# EAGLE design Mikrobus-PIC32MX-USB (EAGLE 7.7.0)
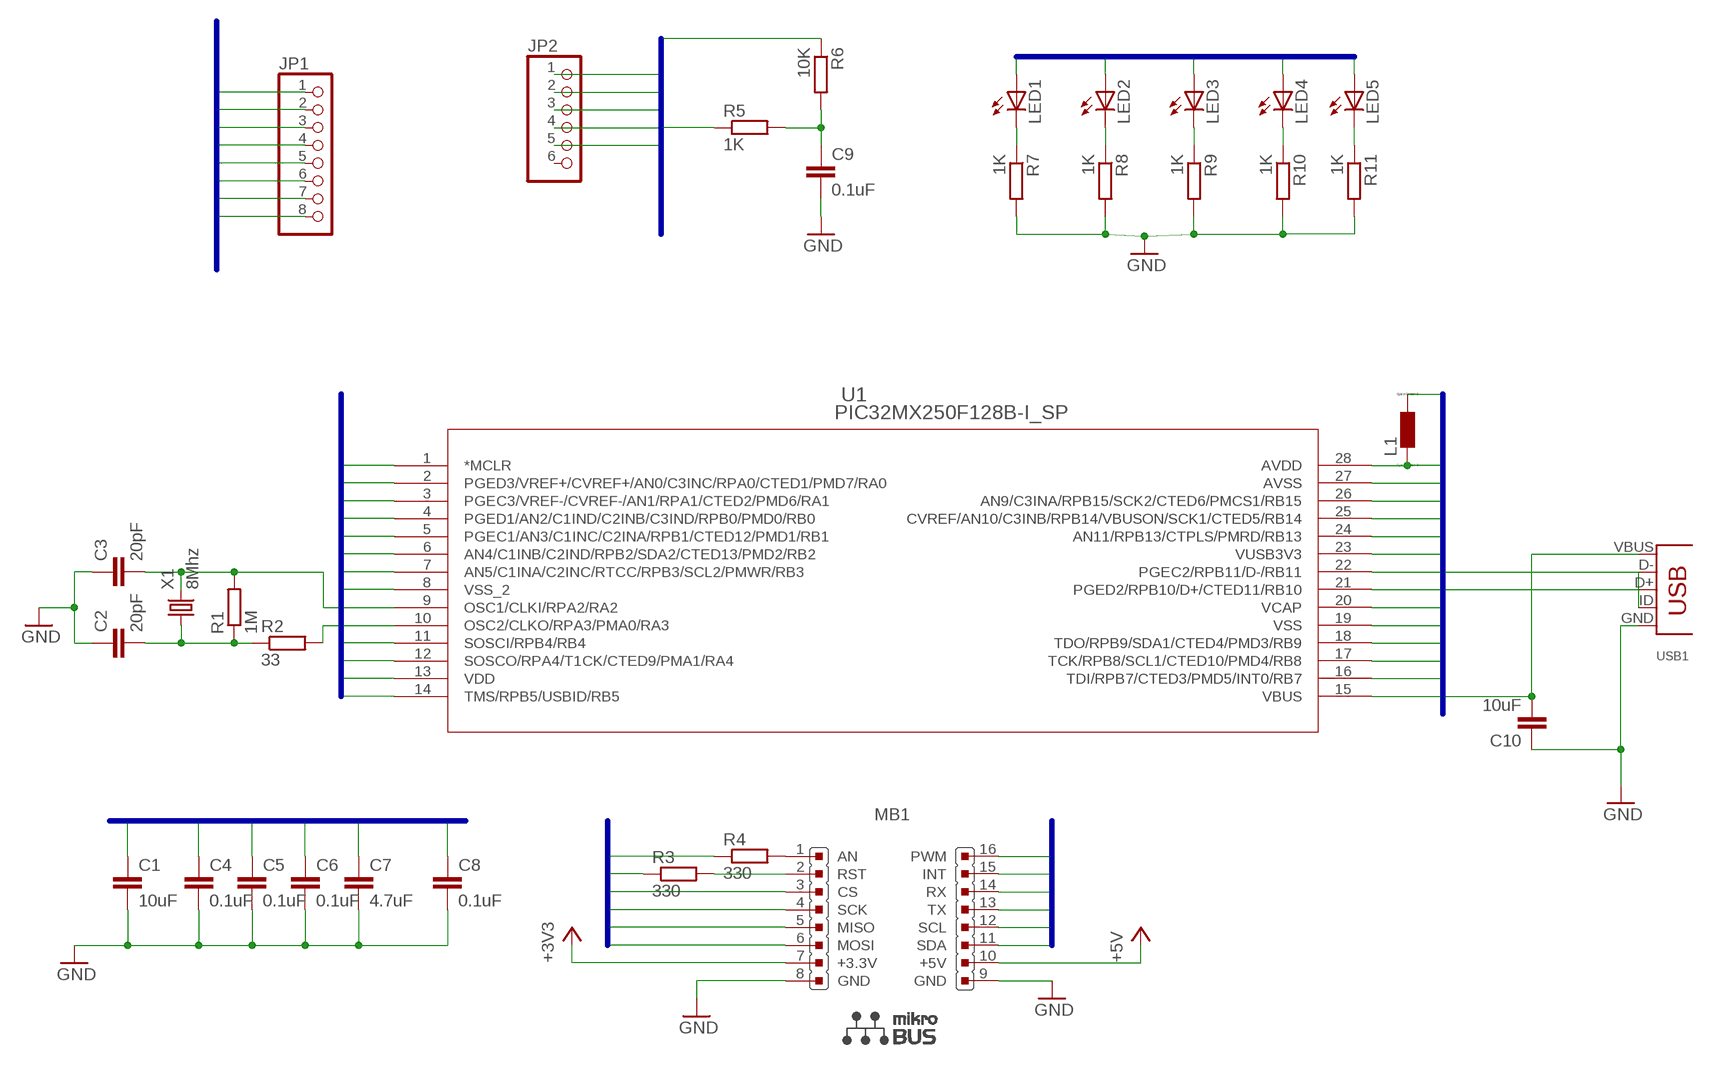
[diagram p0: schematic, sheet 1]

## Parts
C1  10uF  C-EU050-024X044  [C050-024X044]
C2  20pF  C-EU050-024X044  [C050-024X044]
C3  20pF  C-EU050-024X044  [C050-024X044]
C4  0.1uF  C-EU025-024X044  [C025-024X044]
C5  0.1uF  C-EU025-024X044  [C025-024X044]
C6  0.1uF  C-EU025-024X044  [C025-024X044]
C7  4.7uF  C-EU050-024X044  [C050-024X044]
C8  0.1uF  C-EU025-024X044  [C025-024X044]
C9  0.1uF  C-EU025-024X044  [C025-024X044]
C10  10uF  C-EU050-024X044  [C050-024X044]
JP1  PINHD-1X8  [1X08]
JP2  PINHD-1X6  [1X06]
L1  L  [MLF1608]
LED1  LED1.8MM  [LED1.8MM]
LED2  LED1.8MM  [LED1.8MM]
LED3  LED1.8MM  [LED1.8MM]
LED4  LED1.8MM  [LED1.8MM]
LED5  LED1.8MM  [LED1.8MM]
MB1  MIKROBUS  [MIKROBUS]
R1  1M  R-EU_0204/5  [0204/5]
R2  33  R-EU_0204/5  [0204/5]
R3  330  R-EU_0204/5  [0204/5]
R4  330  R-EU_0204/5  [0204/5]
R5  1K  R-EU_0204/5  [0204/5]
R6  10K  R-EU_0204/5  [0204/5]
R7  1K  R-EU_0204/5  [0204/5]
R8  1K  R-EU_0204/5  [0204/5]
R9  1K  R-EU_0204/5  [0204/5]
R10  1K  R-EU_0204/5  [0204/5]
R11  1K  R-EU_0204/5  [0204/5]
U1  PIC32MX250F128B-I_SP  [SPDIP28_300MC]
USB1  MICRO-USB  [USB-WURTH]
X1  8Mhz  CRYSTALS-NOGND-HC49  [HC49]

## Nets
+5V: MB1.10(+5V)
AVDD: C8.1 L1.2 U1.28(AVDD)
D+: U1.21(PGED2/RPB10/D+/CTED11/RB10) USB1.ID(D-)
D-: U1.22(PGEC2/RPB11/D-/RB11) USB1.D+
GND: C1.2 C2.1 C3.1 C4.2 C5.2 C6.2 C7.2 C8.2 C9.2 C10.1 JP1.8 JP2.3 MB1.8(GND) MB1.9(GND) R7.2 R8.2 R9.2 R10.2 R11.2 U1.8(VSS_2) U1.19(VSS) U1.27(AVSS) USB1.GND(VBUS)
INT: MB1.15(INT) U1.14(TMS/RPB5/USBID/RB5)
LED1: LED1.P1(A) U1.2(PGED3/VREF+/CVREF+/AN0/C3INC/RPA0/CTED1/PMD7/RA0)
LED2: LED2.P1(A) U1.26(AN9/C3INA/RPB15/SCK2/CTED6/PMCS1/RB15)
MCLR: JP2.1 R4.1 R5.1 U1.1(*MCLR)
MISO: MB1.5(MISO) U1.17(TCK/RPB8/SCL1/CTED10/PMD4/RB8)
MOSI: JP1.1 MB1.6(MOSI) U1.3(PGEC3/VREF-/CVREF-/AN1/RPA1/CTED2/PMD6/RA1)
N$2: C2.2 R1.1 R2.1 X1.1
N$8: MB1.1(AN) R4.2
N$9: C9.1 R5.2 R6.2
N$11: LED1.P2(C) R7.1
N$12: LED2.P2(C) R8.1
N$13: LED3.P2(C) R9.1
N$14: LED4.P2(C) R10.1
N$15: MB1.2(RST) R3.2
N$16: LED5.P2(C) R11.1
OSC1: C3.2 R1.2 U1.9(OSC1/CLKI/RPA2/RA2) X1.2
OSC2: R2.2 U1.10(OSC2/CLKO/RPA3/PMA0/RA3)
PWM: JP1.6 MB1.16(PWM) U1.24(AN11/RPB13/CTPLS/PMRD/RB13)
RA4: JP1.7 U1.12(SOSCO/RPA4/T1CK/CTED9/PMA1/RA4)
RB4: LED5.P1(A) U1.11(SOSCI/RPB4/RB4)
RB9: R3.1 U1.18(TDO/RPB9/SDA1/CTED4/PMD3/RB9)
RX-PGED: JP1.2
RX/PGED: JP2.4 LED3.P1(A) MB1.14(RX) U1.4(PGED1/AN2/C1IND/C2INB/C3IND/RPB0/PMD0/RB0)
SCK: MB1.4(SCK) U1.25(CVREF/AN10/C3INB/RPB14/VBUSON/SCK1/CTED5/RB14)
SCL: JP1.5 MB1.12(SCL) U1.7(AN5/C1INA/C2INC/RTCC/RPB3/SCL2/PMWR/RB3)
SDA: JP1.4 MB1.11(SDA) U1.6(AN4/C1INB/C2IND/RPB2/SDA2/CTED13/PMD2/RB2)
SS/CS: MB1.3(CS) U1.16(TDI/RPB7/CTED3/PMD5/INT0/RB7)
TX-PGEC: JP1.3
TX/PGEC: JP2.5 LED4.P1(A) MB1.13(TX) U1.5(PGEC1/AN3/C1INC/C2INA/RPB1/CTED12/PMD1/RB1)
VBUS: C10.2 U1.15(VBUS) USB1.VBUS(GND)
VCAP: C1.1 C4.1 U1.20(VCAP)
VDD: C5.1 C6.1 C7.1 JP2.2 L1.1 MB1.7(+3.3V) R6.1 U1.13(VDD) U1.23(VUSB3V3) ; supply symbol labelled +3V3
Unconnected: JP2.6 USB1.D-(ID)

## Buses
MCLR,LED1,VDD,TX/PGEC,RX/PGED,SDA,SCL,MOSI,INT,RA4,VSS
MCLR,AN,RB9,CS,SCK,MISO,MOSI,SS/CS,3V3
PWM,INT,TX/PGEC,RX/PGED,SDA,SCL
SCK,VSS,MISO,SS/CS,RB9,LED2,PWM,VCAP,VDD,AVDD
MCLR,VDD,GND,TX/PGEC,RX/PGED
LED1,LED2,TX/PGEC,RX/PGED,RB4
VSS,AVDD,VCAP
MOSI,RX-PGED,TX-PGEC,SDA,SCL,PWM,RA4,GND

## Library data of the parts
C1-C10 = resistor:C-EU: CAPACITOR, European symbol
JP1 = KS Lib2:PINHD-1X8: PIN HEADER
JP2 = KS Lib2:PINHD-1X6: PIN HEADER
L1 = KS Lib2:L: INDUCTOR, European symbol; SPICEMODEL: NONE; SPICEPREFIX: L
LED1-LED5 = KS Lib2:LED: LED OSRAM: - CHIPLED LG R971, LG N971, LY N971, LG Q971, LY Q971, LO R971, LY R971 LH N974, LH R974 LS Q976, LO Q976, LY Q976 LO Q996 - Hyper CHIPLED LW Q18S LB Q993, LB Q99A, LB R99A - SideLED LS A670, LO A670, LY A670, LG A670, LP A670 LB A673, LV A673, LT A673, LW A673 LH A674 LY A675 LS A676, LA A676, LO A676, LY A676, LW A676 LS A679, LY A679, LG A679 - Hyper Micro SIDELED® LS Y876, LA Y876, LO Y876, LY Y876 LT Y87S - SmartLED LW L88C, LW L88S LB L89C, LB L89S, LG L890 LS L89K, LO L89K, LY L89K LS L896, LA L896, LO L896, LY L896 - TOPLED LS T670, LO T670, LY T670, LG T670, LP T670 LSG T670, LSP T670, LSY T670, LOP T670, LYG T670 LG T671, LOG T671, LSG T671 LB T673, LV T673, LT T673, LW T673 LH T674 LS T676, LA T676, LO T676, LY T676, LB T676, LH T676, LSB T676, LW T676 LB T67C, LV T67C, LT T67C, LS T67K, LO T67K, LY T67K, LW E67C LS E67B, LA E67B, LO E67B, LY E67B, LB E67C, LV E67C, LT E67C LW T67C LS T679, LY T679, LG T679 LS T770, LO T770, LY T770, LG T770, LP T770 LB T773, LV T773, LT T773, LW T773 LH T774 LS E675, LA E675, LY E675, LS T675 LS T776, LA T776, LO T776, LY T776, LB T776 LHGB T686 LT T68C, LB T68C - Hyper Mini TOPLED® LB M676 - Mini TOPLED Santana® LG M470 LS M47K, LO M47K, LY M47K Source: http://www.osram.convergy.de/
MB1 = KS Proto:MIKROBUS: MikroBUS Source: MikroBUS specification <http://www.mikroe.com/downloads/get/1737/mikrobus_specification.pdf> MikroBUS <http://www.mikroe.com/mikrobus/>
R1-R11 = KS Lib2:R-EU_: RESISTOR, European symbol
U1 = Microchip-UltiLib:PIC32MX250F128B-I_SP
USB1 = KS Lib2:MICRO-USB
X1 = IQD-Frequency-Products:CRYSTALS-NOGND: CRYSTALS CAN NOT GROUNDED

## Board
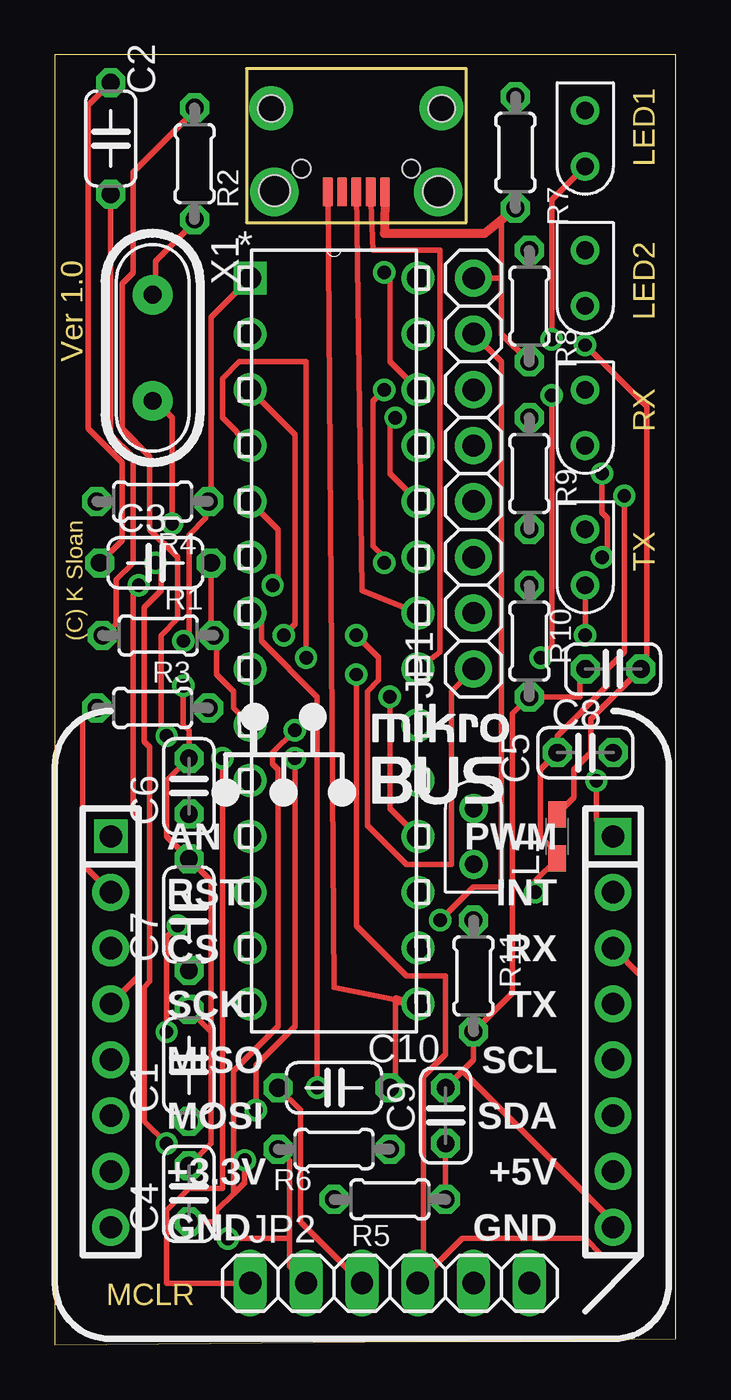
[diagram p1: board, top side]
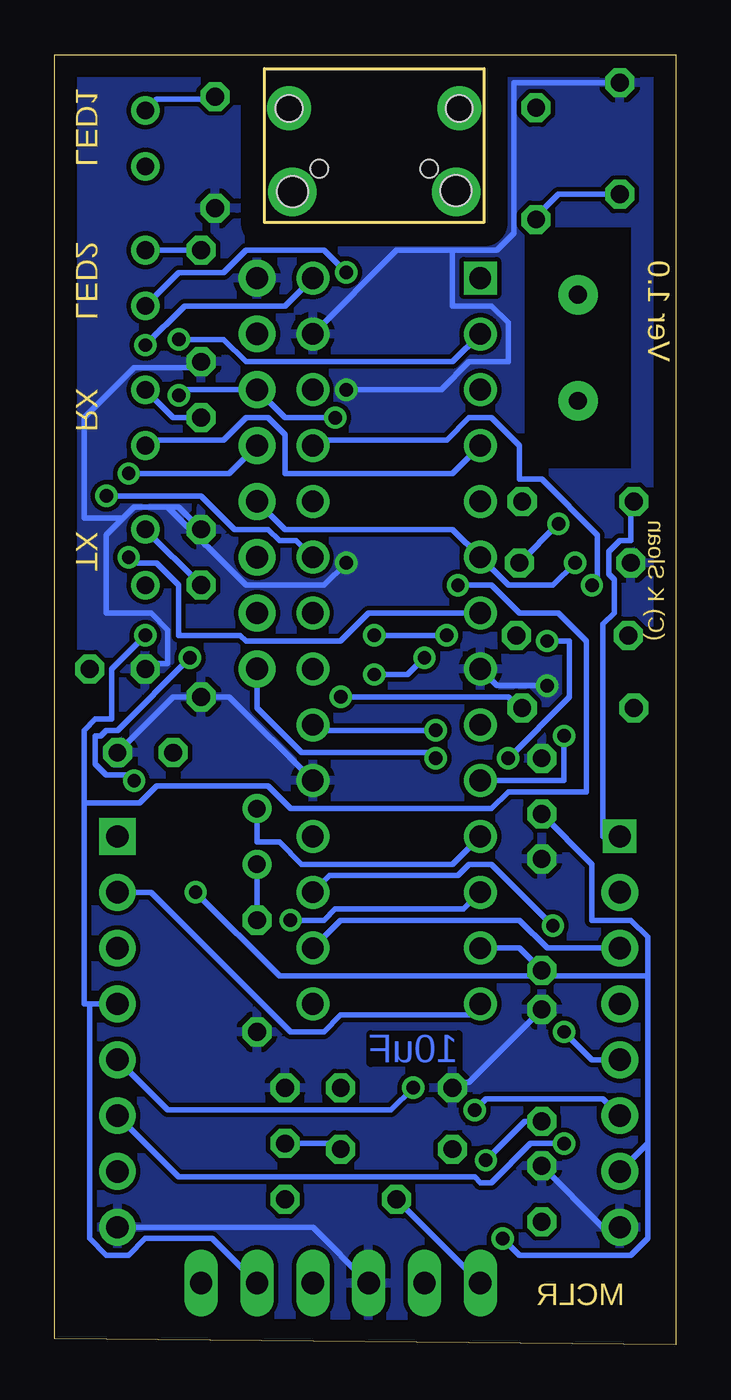
[diagram p2: board, bottom side, seen from below]

Size 28.25 x 58.66 mm. Coordinates in mm from the lower left corner, seen from the top.
Outline: 0,0 28.25,0.25 28.25,58.66 0,58.66 0,0
Copper layers (1*16): Top 0.035mm / dielectric 1.5mm / Bottom 0.035mm
Design rules "default": minimum track width 10mil, minimum drill 24mil, track to track 8mil, track to pad 8mil, pad to pad 8mil, via to via 8mil, smd to smd 8mil, copper to edge 40mil, drill to drill 8mil, minimum pad ring 10mil, minimum via ring 8mil, stop-mask expansion 4mil, vias tented up to drill 0mil, thermal gap 10mil
bRestrict: area 2,39.9 to 6.9,50.8

### Footprints (pad centres in the part's own frame; a part is rotated, then mirrored left to right if it is on the bottom)
C050-024X044 = drill 0.813 octagon: 1 -2.54,0; 2 2.54,0
C025-024X044 = drill 0.813 octagon: 1 -1.27,0; 2 1.27,0
1X08 = drill 1.016 pad 1.676: 1 -8.89,0; 2 -6.35,0; 3 -3.81,0; 4 -1.27,0; 5 1.27,0; 6 3.81,0; 7 6.35,0; 8 8.89,0
1X06 = drill 1.016 long: 1 -6.35,0; 2 -3.81,0; 3 -1.27,0; 4 1.27,0; 5 3.81,0; 6 6.35,0
MLF1608 = smd 1.2 x 0.8: 1 -1,0; 2 1,0
LED1.8MM = drill 0.8: P1 -1.27,0; P2 1.27,0
MIKROBUS = drill 1.016 square: 1 -11.43,7.62 | drill 1.016 pad 1.676: 2 -11.43,5.08; 3 -11.43,2.54; 4 -11.43,0; 5 -11.43,-2.54; 6 -11.43,-5.08; 7 -11.43,-7.62; 8 -11.43,-10.16; 9 11.43,-10.16; 10 11.43,-7.62; 11 11.43,-5.08; 12 11.43,-2.54; 13 11.43,0; 14 11.43,2.54; 15 11.43,5.08 | drill 1.016 pad 1.676 square: 16 11.43,7.62
0204/5 = drill 0.813 octagon: 1 -2.54,0; 2 2.54,0
SPDIP28_300MC = drill 0.991 square: 1 -7.62,33.02 | drill 0.991: 2 -7.62,30.48; 3 -7.62,27.94; 4 -7.62,25.4; 5 -7.62,22.86; 6 -7.62,20.32; 7 -7.62,17.78; 8 -7.62,15.24; 9 -7.62,12.7; 10 -7.62,10.16; 11 -7.62,7.62; 12 -7.62,5.08; 13 -7.62,2.54; 14 -7.62,0; 15 0,0; 16 0,2.54; 17 0,5.08; 18 0,7.62; 19 0,10.16; 20 0,12.7; 21 0,15.24; 22 0,17.78; 23 0,20.32; 24 0,22.86; 25 0,25.4; 26 0,27.94; 27 0,30.48; 28 0,33.02
USB-WURTH = smd 0.42 x 1.3: D+ 0,5.6; D- 0.65,5.6; GND -1.3,5.6; ID -0.65,5.6; VBUS 1.3,5.6 | drill 1.2 pad 2: P$1 -3.875,1.8; P$2 3.875,1.8 | drill 1.4 pad 2.2: P$3 -3.725,5.6; P$4 3.725,5.6 | hole 1.4: -3.725,5.6; 3.725,5.56 | hole 1.2: -3.875,1.8; 3.875,1.8 | hole 0.8: -2.5,4.55; 2.5,4.55
HC49 = drill 0.813 pad 1.8: 1 -2.413,0; 2 2.413,0

### Placement (x,y rotation side)
C1  6.1,12.7 90 top
C2  2.54,54.86 270 top
C3  4.57,35.56 0 top
C4  6.1,6.86 90 top
C5  24.13,26.92 0 top
C6  6.1,25.4 90 top
C7  6.1,19.56 90 top
C8  25.4,30.73 180 top
C9  17.78,10.41 90 top
C10  12.7,11.68 0 top
JP1  19.05,39.62 90 top
JP2  15.24,2.79 0 top
L1  22.86,23.11 90 top
LED1  24.13,54.86 90 top
LED2  24.13,48.51 90 top
LED3  24.13,42.16 90 top
LED4  24.13,35.81 90 top
LED5  19.05,23.11 270 top
MB1  13.97,15.49 0 top
R1  4.7,32.26 0 top
R2  6.35,53.72 90 top
R3  4.45,28.96 180 top
R4  4.45,38.35 180 top
R5  15.24,6.6 0 top
R6  12.7,8.89 0 top
R7  20.95,54.23 270 top
R8  21.59,47.24 270 top
R9  21.59,39.62 270 top
R10  21.59,32 270 top
R11  19.05,16.76 270 top
U1  16.51,15.49 0 top
USB1  13.72,58.04 180 top
X1  4.45,45.34 270 top

### Tracks (layer width: path | path; a pad name or v marks a point on that pad's centre or on a via)
AVDD  (via drill 0.61)
  Top 0.254: L1.2 22.86,24.13 23.62,24.89 23.62,26.16 24.38,26.92 24.38,28.45 C8.1 26.92,30.99 26.92,42.67 v24.13,45.47
  Bottom 0.254: U1.28 17.78,47.24 22.35,47.24 v24.13,45.47
D+
  Top 0.254: USB1.ID 14.48,49.78 17.53,49.78 17.53,31.5 U1.21
D-
  Top 0.254: USB1.D+ 13.97,34.29 U1.22
GND  (via drill 0.61)
  Top 0.254: C3.1 3.05,36.58 3.05,40.13 1.52,41.66 1.52,56.39 C2.1 | R8.2 20.32,45.97 20.32,48.51 | 20.32,48.51 20.32,51.05 20.26,51.12 | 20.32,48.51 JP1.8 | C8.2 23.88,30.48 23.88,29.46 R10.2 20.83,28.7 20.83,16 R11.2 19.05,12.95 18.54,12.45 | 18.54,12.45 C9.2 | 18.54,12.45 25.4,5.59 MB1.9 | v5.84,29.97 5.84,28.19 6.1,27.94 C6.2 5.08,25.65 5.08,23.11 C7.2 7.11,21.08 7.11,14.22 | C4.2 7.11,9.14 7.11,14.22 | C1.2 7.11,14.22 | JP2.3 11.18,5.59 11.18,10.67 C10.1 | v14.99,43.43 14.48,42.93 14.48,36.32 14.99,35.81 v14.99,35.56
  Top 0.406: USB1.GND 14.99,50.55 19.56,50.55 20.26,51.12 R7.2
  Bottom 0.254: U1.27 12.7,49.78 10.16,49.78 | 10.16,49.78 8.13,49.78 7.37,50.55 7.37,57.4 C2.1 | R9.2 22.61,38.1 23.11,38.1 | 23.11,38.1 24.64,38.1 25.15,37.59 | 25.15,37.59 25.91,36.83 25.91,33.27 23.88,33.27 23.11,32.51 23.11,30.99 23.88,30.99 C8.2 | C5.2 22.86,29.46 R10.2 20.32,29.46 U1.19 | R8.2 21.84,44.45 24.64,44.45 26.92,42.16 26.92,37.59 25.15,37.59 | JP2.3 16.51,5.33 MB1.9 | U1.8 8.13,29.97 v5.84,29.97 | C4.2 3.3,5.33 MB1.8 | C10.1 9.91,11.94 9.4,11.94 C1.2 | 10.16,49.78 10.16,47.24 8.38,47.24 7.62,46.48 7.62,44.7 9.4,44.7 10.67,43.43 v14.99,43.43 | v14.99,35.56 16,34.54 19.56,34.54 23.11,38.1
  pour Bottom: 0.25,58.42 27.94,58.42 27.94,0.51 0.25,0.51
INT
  Bottom 0.254: U1.14 9.4,14.99 15.24,14.99 16,14.22 17.53,14.22 23.88,20.57 MB1.15
LED1  (via drill 0.61)
  Top 0.254: LED1.P1 22.61,52.07 v22.61,45.72
  Bottom 0.254: v22.61,45.72 20.57,45.72 19.56,44.7 10.16,44.7 U1.2
LED2  (via drill 0.61)
  Top 0.254: v14.99,48.77 15.24,48.51 15.24,44.7 U1.26
  Bottom 0.254: LED2.P1 22.61,48.77 20.57,48.77 19.56,49.78 16,49.78 v14.99,48.77
MCLR  (via drill 0.61)
  Top 0.254: U1.1 7.11,46.74 7.11,38.35 R4.1 6.86,38.35 6.86,37.59 6.1,36.83 6.1,32.26 v5.84,32 | JP2.1 5.08,2.79 5.08,6.1 6.1,7.11 7.62,7.11 v7.62,26.67
  Bottom 0.254: JP2.1 R5.1 | v7.62,26.67 4.83,29.46 4.83,32 v5.84,32
MISO  (via drill 0.61)
  Top 0.254: v5.59,19.05 5.08,18.54 v5.08,14.22
  Bottom 0.254: U1.17 15.75,21.34 9.91,21.34 9.4,21.84 8.38,21.84 v5.59,19.05 | v5.08,14.22 3.81,12.95 MB1.5
MOSI  (via drill 0.61)
  Top 0.254: U1.3 10.92,41.4 10.92,32.77 v10.41,32.26 | v13.72,32.26 14.73,31.24 14.73,30.23 14.22,29.72 14.22,23.62 16,21.84 18.03,21.84 18.03,29.72 JP1.1 | v9.14,10.67 9.14,12.7 10.92,14.48 v10.92,26.67
  Bottom 0.254: v13.72,32.26 v10.41,32.26 | MB1.6 3.3,11.18 8.64,11.18 v9.14,10.67 | v10.92,26.67 11.18,26.92 17.02,26.92 19.05,28.96 JP1.1
N$2
  Top 0.254: R2.1 6.35,51.05 4.57,49.28 4.57,47.75 X1.1 | C2.2 2.54,41.4 3.56,40.39 3.56,35.56 2.79,34.8 2.79,32.77 2.29,32.26 R1.1
  Bottom 0.254: C2.2 5.33,52.32 6.35,51.31 R2.1
N$8
  Bottom 0.254: MB1.1 3.3,23.11 3.3,32.77 2.79,33.27 2.79,34.8 3.05,35.05 3.05,36.07 2.54,36.58 2.03,36.58 2.03,38.35 R4.2
N$9
  Top 0.254: C9.1 R5.2
  Bottom 0.254: R6.2 15.49,9.14 C9.1
N$11
  Bottom 0.254: LED1.P2 23.62,56.64 21.08,56.64 R7.1
N$12
  Bottom 0.254: R8.1 LED2.P2
N$13
  Bottom 0.254: LED3.P2 22.86,42.16 R9.1
N$14
  Bottom 0.254: R10.1 LED4.P2
N$15
  Top 0.254: MB1.2 1.27,21.84 1.27,28.45 1.78,28.96 R3.2
N$16
  Bottom 0.254: R11.1 LED5.P2
OSC1  (via drill 0.61)
  Top 0.254: C3.2 7.11,32.26 R1.2 7.37,32.26 7.37,30.48 8.13,29.72 8.13,28.96 U1.9 | v5.33,37.34 5.33,42.16 4.57,42.93 X1.2
  Bottom 0.254: C3.2 v5.33,37.34
OSC2  (via drill 0.61)
  Top 0.254: v5.08,27.69 4.83,27.94 4.83,32.26 5.59,33.02 5.59,35.81 4.32,37.08 4.32,40.39 3.05,41.66 3.05,48.26 3.56,48.77 3.56,53.34 6.35,56.13 R2.2
  Bottom 0.254: v5.08,27.69 5.08,25.65 U1.10
PWM  (via drill 0.61)
  Top 0.254: U1.24 15.24,39.62 15.24,41.91 v15.49,42.16 | MB1.16 24.64,23.88 v24.64,25.65 | v22.1,31.24 22.61,31.75 v22.61,43.18
  Bottom 0.254: v15.49,42.16 17.78,42.16 JP1.6 22.35,43.43 v22.61,43.18 | v24.64,25.65 24.89,25.91 25.91,25.91 26.42,26.42 26.42,27.69 26.16,27.69 25.91,27.94 25.4,27.94 v22.1,31.24
RA4  (via drill 0.61)
  Top 0.254: v17.53,19.3 19.05,20.83 20.32,20.83 20.32,44.7 JP1.7
  Bottom 0.254: U1.12 9.65,19.81 15.49,19.81 16,19.3 v17.53,19.3
RB4
  Bottom 0.254: LED5.P1 19.05,22.86 18.03,22.86 17.02,21.84 10.16,21.84 U1.11
RB9  (via drill 0.61)
  Top 0.254: v15.24,29.46 15.24,24.38 U1.18
  Bottom 0.254: v15.24,29.46 7.62,29.46 7.11,28.96 R3.1
RX/PGED  (via drill 0.61)
  Top 0.254: 16.76,3.05 18.54,4.83 24.13,4.83 24.89,4.06 26.67,4.06 26.67,16.76 MB1.14 | U1.4 7.62,42.16 7.62,43.94 8.38,44.7 11.43,44.7 v11.43,31.24 | v13.72,30.48 13.72,19.05 16,16.76 17.78,16.76 17.78,13.21 16.76,12.19 16.76,3.05 | 16.76,3.05 JP2.4
  Bottom 0.254: LED3.P1 23.88,41.15 20.57,41.15 19.56,42.16 18.54,42.16 17.78,41.4 17.78,39.62 10.16,39.62 U1.4 | v11.43,31.24 12.19,30.48 v13.72,30.48
SCK  (via drill 0.61)
  Top 0.254: v3.81,34.54 3.56,34.29 3.56,24.13 3.81,23.88 3.81,16.76 MB1.4
  Bottom 0.254: U1.25 16.26,41.15 10.41,41.15 9.4,42.16 8.38,42.16 7.11,40.89 7.11,39.37 6.1,39.37 3.56,36.83 3.56,34.54 v3.81,34.54
SCL  (via drill 0.61)
  Top 0.254: U1.7 9.4,32.77 9.4,32 11.94,29.46 v11.94,11.68 | v24.89,39.62 24.89,37.85 25.15,37.59 25.15,36.07 v24.89,35.81
  Bottom 0.254: v11.94,11.68 12.95,10.67 23.11,10.67 MB1.12 | JP1.5 20.32,39.62 v24.89,39.62 | v24.89,35.81 24.64,35.56 23.62,35.56 22.61,34.54 22.61,32.26 19.81,32.26 19.56,32 15.24,32 13.97,33.27 U1.7
SDA  (via drill 0.61)
  Top 0.254: v5.08,9.14 4.06,10.16 4.06,16.26 4.32,16.51 4.32,27.18 4.06,27.43 4.06,33.53 4.83,34.29 4.83,35.31 v4.57,35.56
  Bottom 0.254: JP1.4 17.78,37.08 10.16,37.08 U1.6 7.62,34.54 5.59,34.54 v4.57,35.56 | MB1.11 22.61,7.62 9.14,7.62 8.89,7.37 8.38,7.37 6.6,9.14 v5.08,9.14
SS/CS
  Bottom 0.254: U1.16 15.24,19.3 7.11,19.3 5.84,18.03 MB1.3
TX/PGEC  (via drill 0.61)
  Top 0.254: v24.13,32.26 LED4.P1 | U1.5 10.16,37.08 10.16,34.8 v9.91,34.54
  Bottom 0.254: v24.13,32.26 25.65,30.73 25.65,28.45 26.42,28.45 26.92,27.94 26.92,24.64 | 26.92,24.64 26.92,15.49 26.67,15.49 | MB1.13 26.67,15.49 | v9.91,34.54 8.38,34.54 7.11,33.27 5.33,33.27 4.06,32 4.06,25.15 7.62,25.15 8.38,24.38 17.53,24.38 18.54,25.4 23.62,25.4 24.38,24.64 26.92,24.64 | JP2.5 21.08,4.83 24.13,4.83 24.89,4.06 25.91,4.06 26.67,4.83 26.67,15.49
VBUS
  Top 0.254: USB1.VBUS 12.7,16.26 15.53,15.69 15.49,15.49 15.49,11.94 C10.2
  Top 0.406: 15.53,15.69 U1.15
VCAP  (via drill 0.61)
  Top 0.254: C4.1 7.37,5.59 7.37,6.1 8.13,6.86 | 8.13,6.86 8.64,7.37 v8.64,8.38 | v10.92,27.94 9.91,26.92 9.91,26.42 10.16,26.16 10.16,14.48 8.13,12.45 8.13,6.86
  Bottom 0.254: v8.64,8.38 6.86,10.16 C1.1 | U1.20 16.26,27.94 v10.92,27.94
VDD  (via drill 0.61)
  Top 0.254: v25.91,38.61 25.91,31.5 25.15,30.73 25.15,29.97 22.86,27.69 C5.1 22.1,26.16 22.1,23.11 22.86,22.35 L1.1 22.86,22.1 21.84,21.08 v21.84,20.57 | R6.1 10.67,8.38 10.67,4.83 | 10.67,4.83 10.67,3.56 JP2.2 | v7.87,4.83 10.67,4.83
  Bottom 0.254: U1.23 17.27,36.58 18.03,36.58 18.54,37.08 20.07,37.08 21.59,38.61 v25.91,38.61 | U1.13 7.11,18.03 C7.1 5.84,16.76 | C6.1 3.81,21.84 3.81,19.3 2.03,19.3 1.27,18.54 1.27,16.76 | 5.84,16.76 1.27,16.76 | 1.27,9.14 MB1.7 | 1.27,16.76 1.27,9.14 | v7.87,4.83 7.11,4.06 2.03,4.06 1.27,4.83 1.27,9.14 | v21.84,20.57 18.03,16.76 5.84,16.76

### Text on the board
Dimension: LED1 | LED2 | Ver 1.0 | RX | TX | (C) K Sloan | MCLR